# EAGLE design Grove - Mouse Encoder v1.0 (EAGLE 7.2.0)

## Sheet 1 of 3
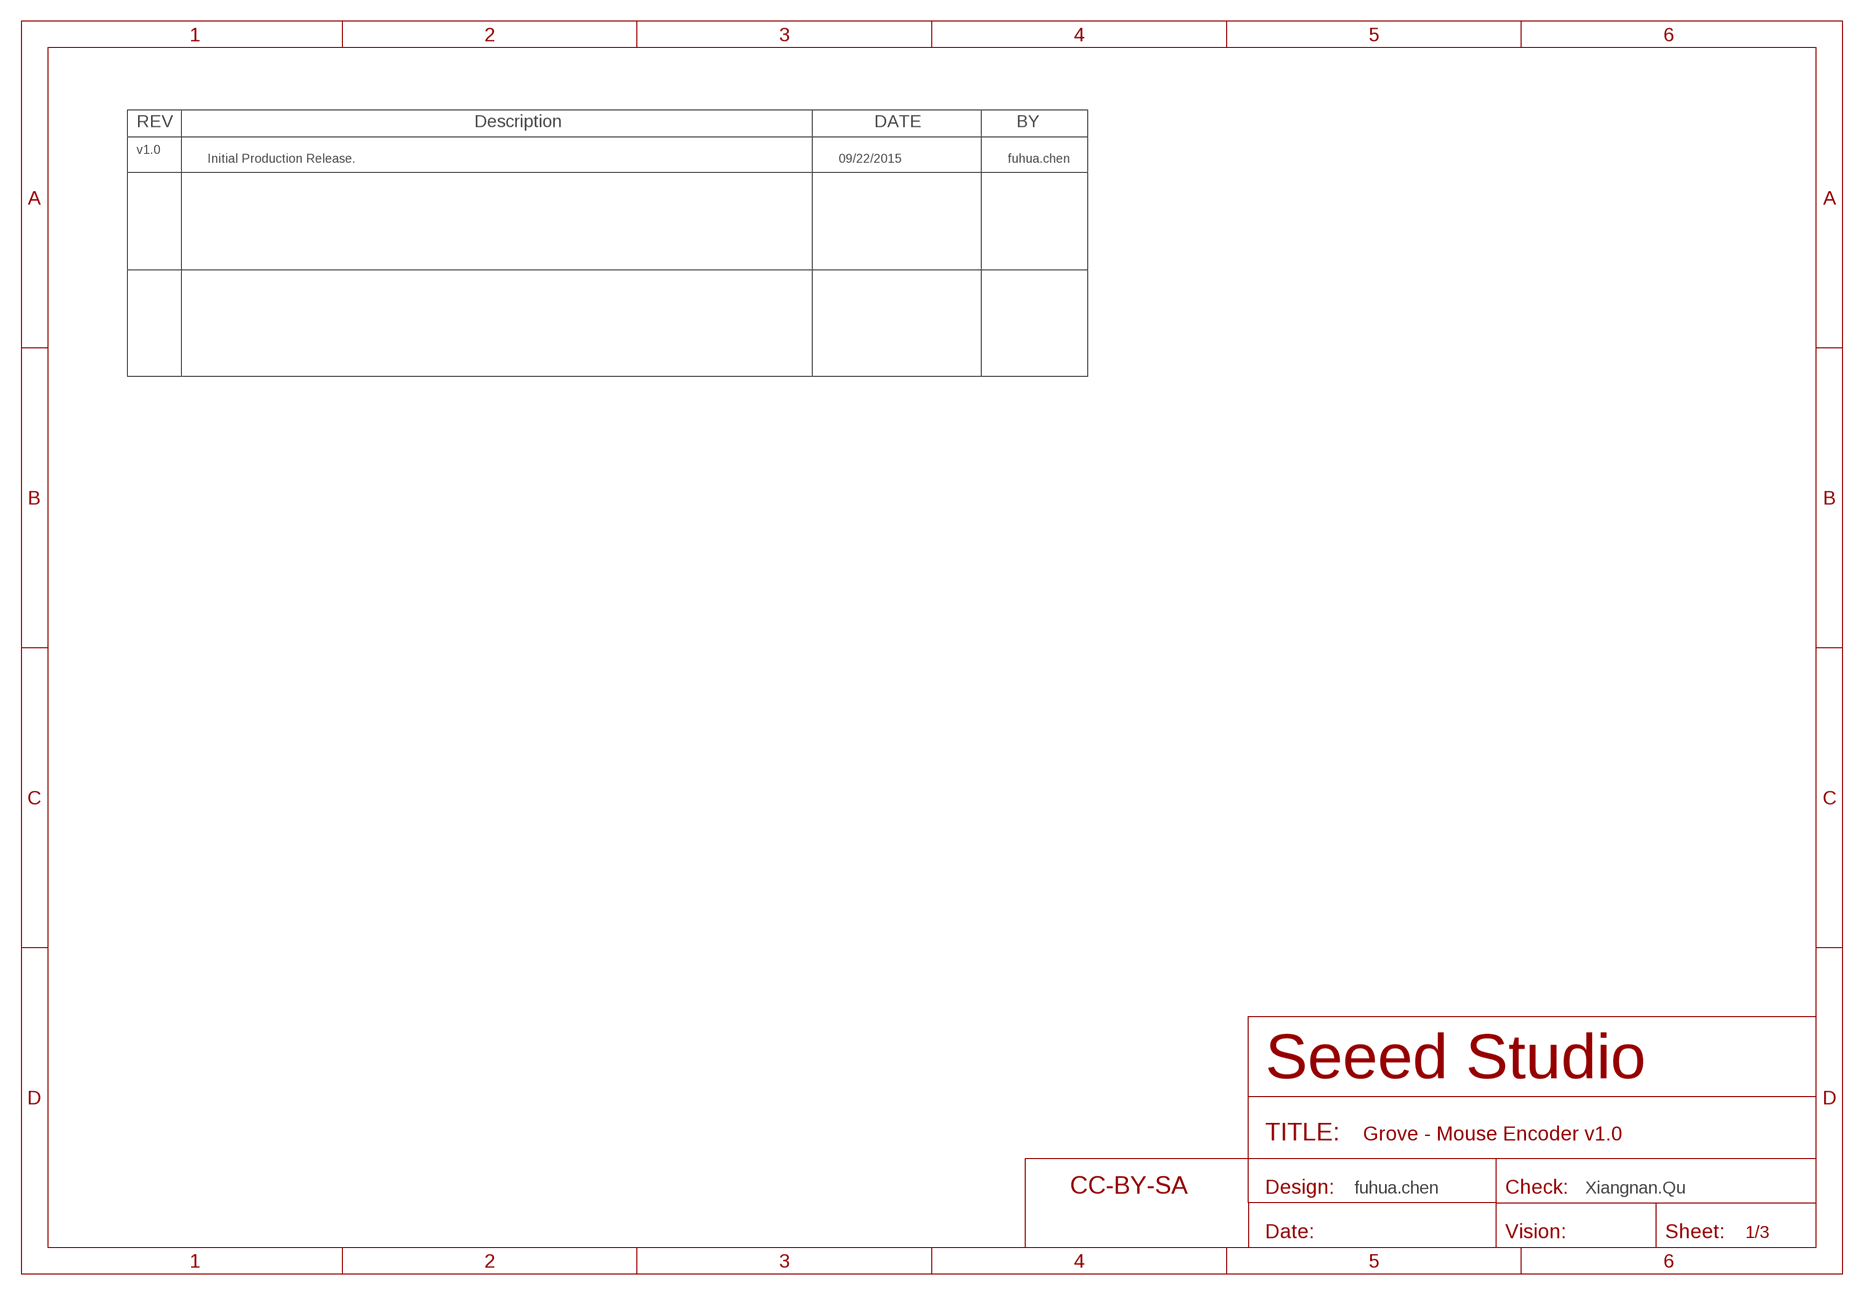
[diagram p0: schematic, sheet 1]

### Parts
U$5  SEEEDSTUDIO-OPEN-SCH-FRAME  [SEEEDSTUDIO-PCB-FRAME]

### Notes on the sheet
- REV | Description | DATE | BY
- v1.0
- Initial Production Release. | 09/22/2015 | fuhua.chen
- fuhua.chen | Xiangnan.Qu

## Sheet 2 of 3
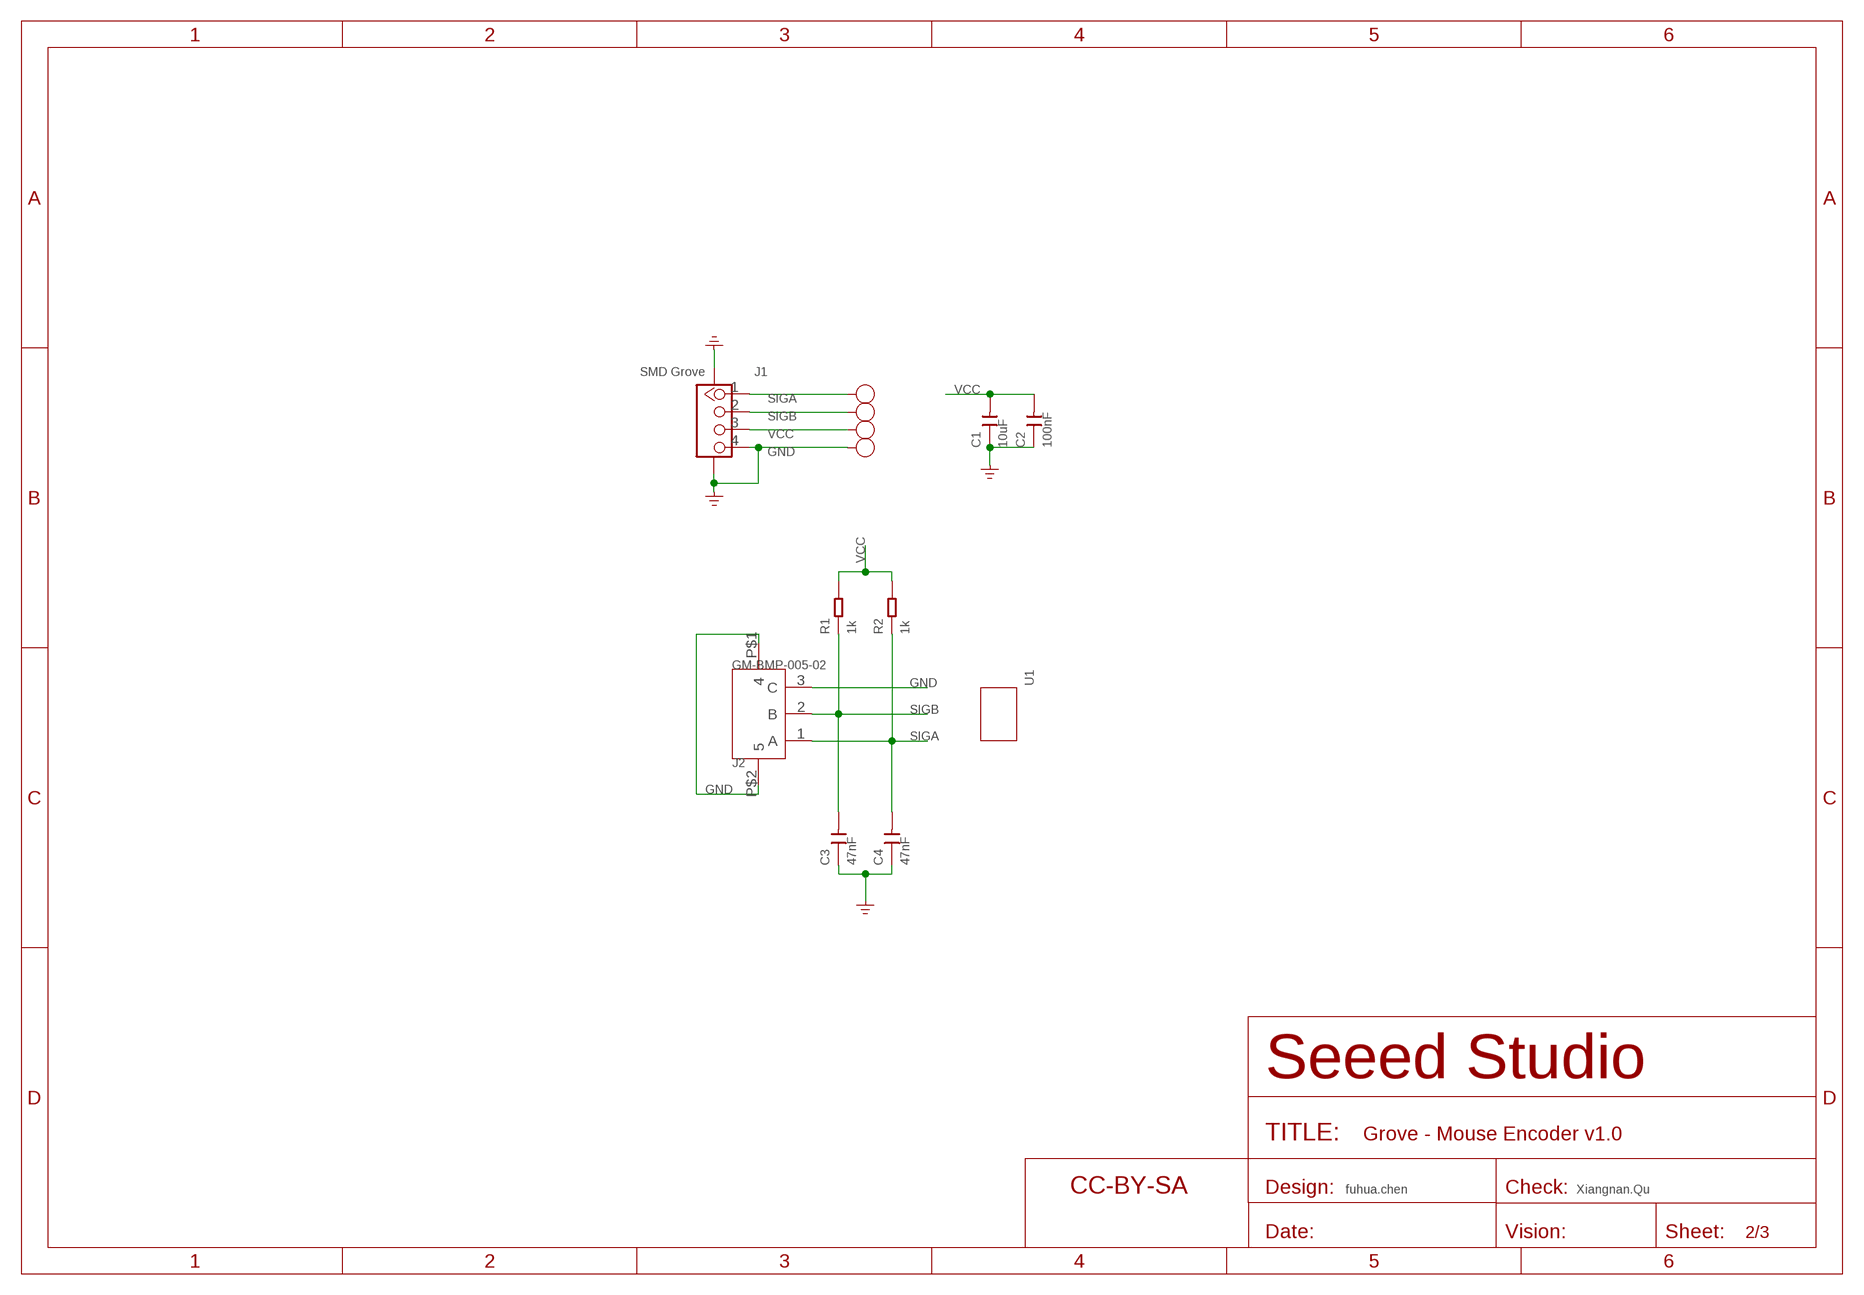
[diagram p1: schematic, sheet 2]

### Parts
C1  10uF  CAP-0603  [C0603]
C2  100nF  CAP-0603  [C0603]
C3  47nF  CAP-0603  [C0603]
C4  47nF  CAP-0603  [C0603]
FR1  SEEEDSTUDIO-OPEN-SCH-FRAME  [SEEEDSTUDIO-PCB-FRAME]
GND  GND  TEST-POINT'4545'  [TP-D45MIL]
J1  SMD Grove  GROVE-CONNECTOR-SMD'90D'  [HW4-SMD-2.0-90D]
J2  GM-BMP-005-02  ENCODER-BM002  [DIP5-2.5-10.8X6.8X11.1MM]
R1  1k  RES-0603  [R0603]
R2  1k  RES-0603  [R0603]
SIGA  SIGA  TEST-POINT'4545'  [TP-D45MIL]
SIGB  SIGB  TEST-POINT'4545'  [TP-D45MIL]
U1  GROVE'1U'  [GROVE-1X1-TEST-PLATFORM]
VCC  VCC  TEST-POINT'4545'  [TP-D45MIL]

### Nets
GND: C1.1 C2.1 C3.1 C4.1 GND.T J1.4 J1.SS1 J1.SS2 J2.3(C) J2.P$1 J2.P$2 ; supply symbol labelled GND_POWER
SIGA: C4.2 J1.1 J2.1(A) R2.1 SIGA.T
SIGB: C3.2 J1.2 J2.2(B) R1.1 SIGB.T
VCC: C1.2 C2.2 J1.3 R1.2 R2.2 VCC.T

### Notes on the sheet
- fuhua.chen | Xiangnan.Qu

## Sheet 3 of 3
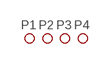
[diagram p2: schematic, sheet 3]

### Parts
P1  PAD-MARK'ANNULAR'  [ROUND-MARK-1.0]
P2  PAD-MARK'ANNULAR'  [ROUND-MARK-1.0]
P3  PAD-MARK'ANNULAR'  [ROUND-MARK-1.0]
P4  PAD-MARK'ANNULAR'  [ROUND-MARK-1.0]

## Library data of the parts
C1-C4 = Discrete-new:CAP: Ceramic Capacitors
FR1 U$5 = moudle-new:SEEEDSTUDIO-OPEN-SCH-FRAME
GND SIGA SIGB VCC = Discrete-new:TEST-POINT; PARTNO: DNP
J1 = Connector-new:GROVE-CONNECTOR-SMD: 4P-SMD-2.0:320110030;4P-SMD-2.0-90D:320110032
J2 = template:ENCODER-BM002
P1-P4 = Discrete-new:PAD-MARK; PARTNO: DNP
R1 R2 = Discrete-new:RES
U1 = moudle-new:GROVE

## Board
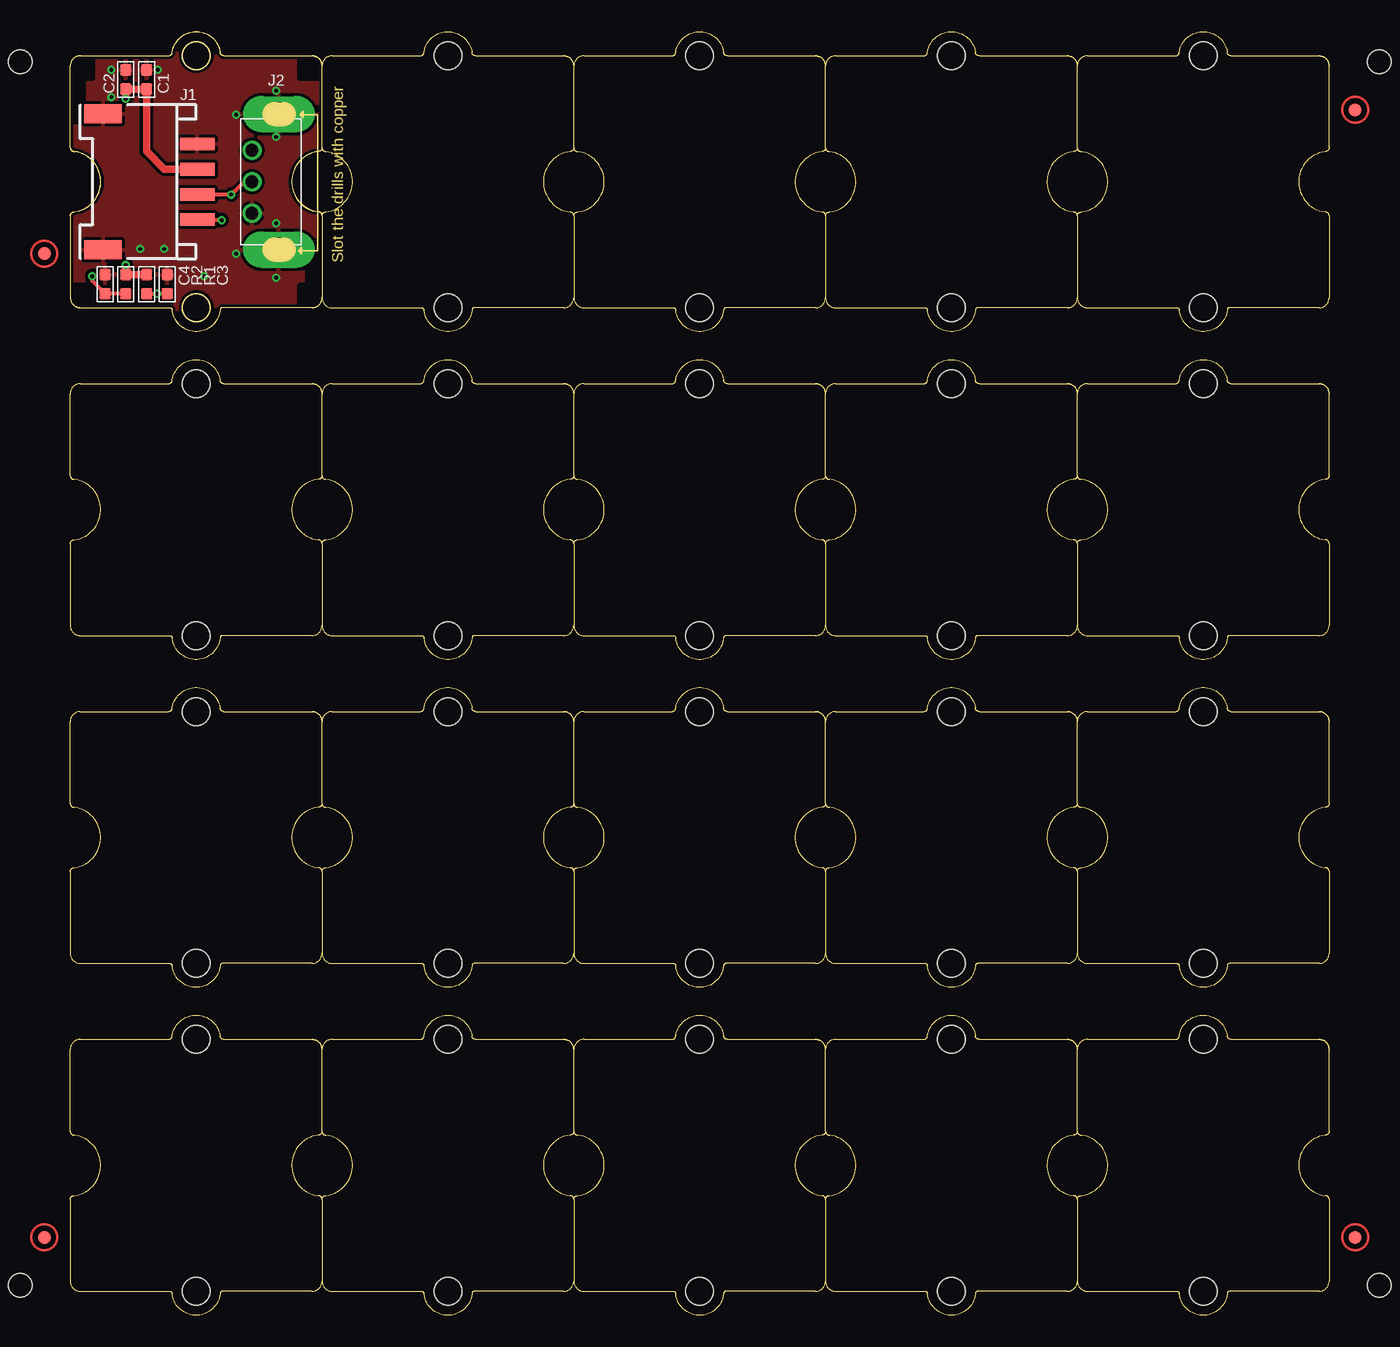
[diagram p3: board, top side]
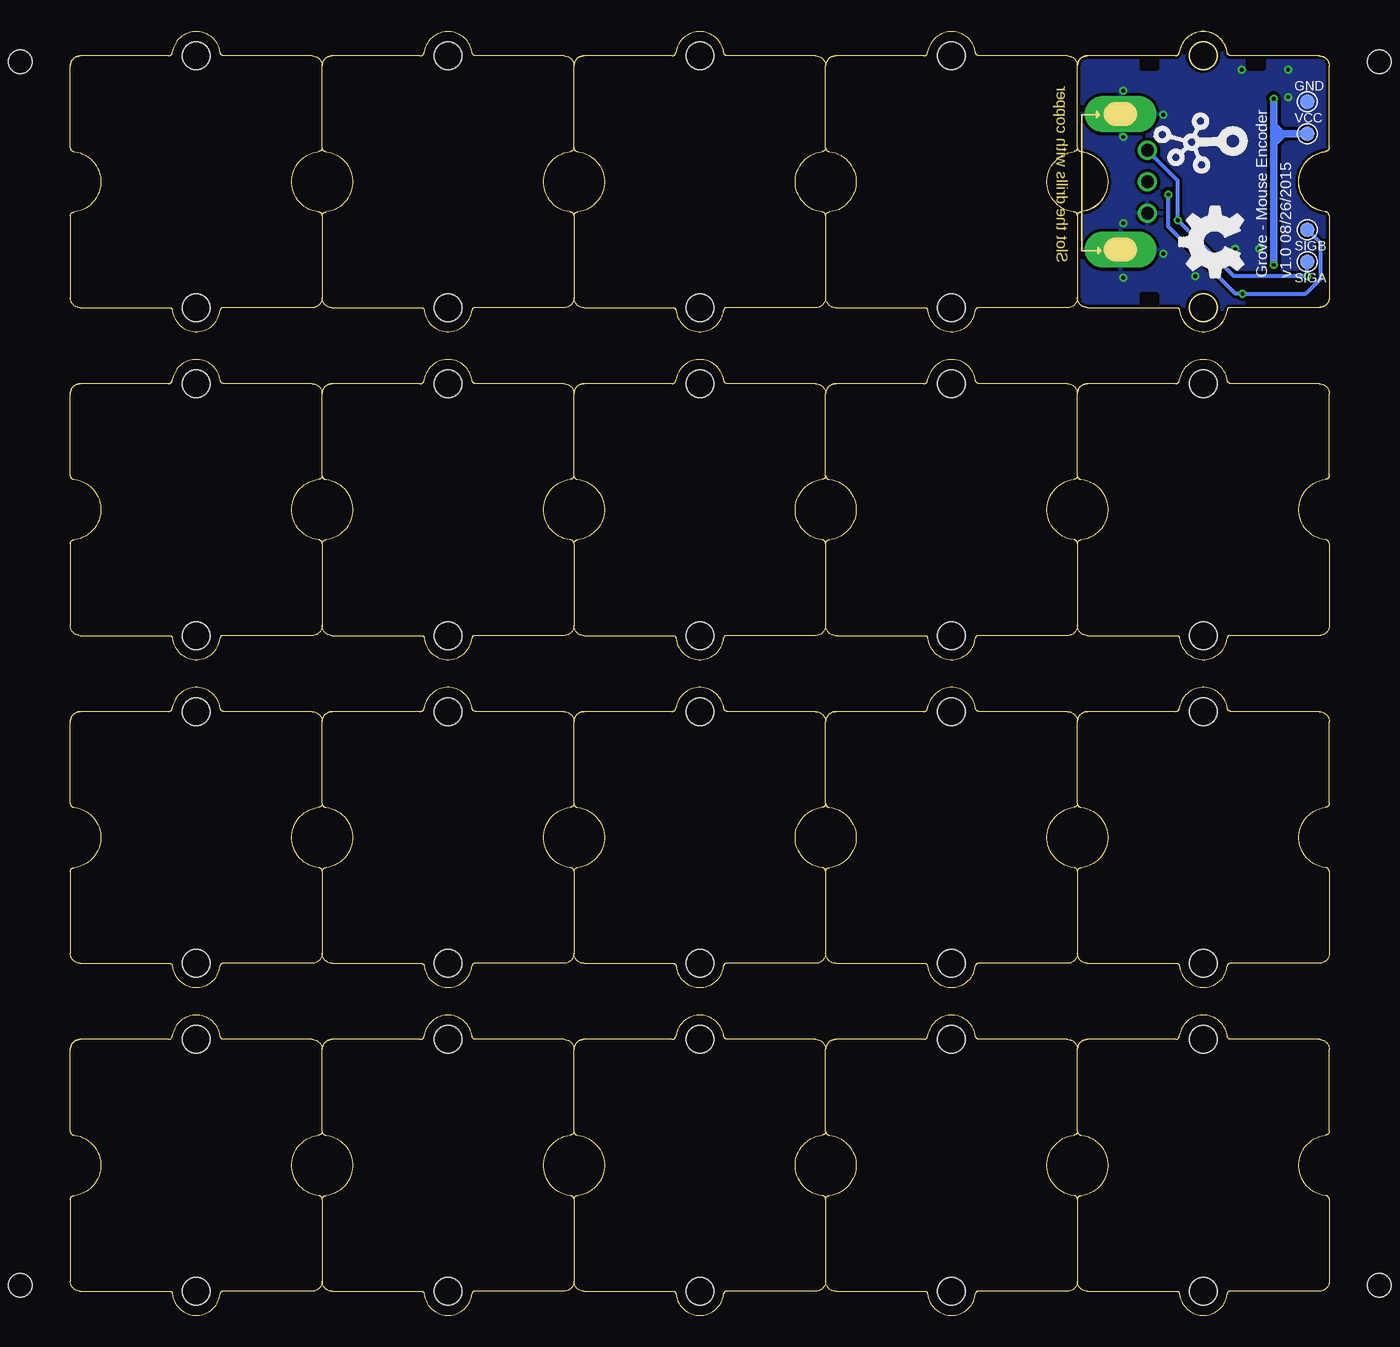
[diagram p4: board, bottom side, seen from below]

Size 100 x 101.95 mm. Coordinates in mm from the lower left corner, seen from the top.
Copper layers (1*16): Top 0.035mm / dielectric 1.5mm / Bottom 0.035mm
Design rules "SeeedStudio_2layer_DRU_no_angle_20140221 *": minimum track width 6mil, minimum drill 12mil, track to track 6mil, track to pad 6mil, pad to pad 6mil, via to via 6mil, smd to smd 0mil, copper to edge 10mil, drill to drill 10mil, minimum pad ring 10mil, minimum via ring 6mil, stop-mask expansion 2mil, vias tented up to drill 25mil, thermal gap 10mil
Holes 1.91 mm at -3.97,2.38 -3.97,99.54 103.98,99.54 103.98,2.38

### Footprints (pad centres in the part's own frame; a part is rotated, then mirrored left to right if it is on the bottom)
C0603 = smd 0.889 x 0.889: 1 0,0.762; 2 0,-0.762
TP-D45MIL = smd 1.143 x 1.143: T 0,0
HW4-SMD-2.0-90D = smd 1.01 x 2.74: 1 -3,-0.1; 2 -1,-0.1; 3 1,-0.1; 4 3,-0.1 | smd 1.5 x 3: SS1 -5.4,7.4; SS2 5.4,7.4
DIP5-2.5-10.8X6.8X11.1MM = drill 1: 1 -2.5,0; 2 0,0; 3 2.5,0 | drill 1.9 pad 2.2 long: P$1 5.38,2.127; P$2 -5.38,2.127
ROUND-MARK-1.0 = smd 1.016 x 1.016: P$1 0,0
R0603 = smd 0.889 x 0.889: 1 0,0.762; 2 0,-0.762
GROVE-1X1-TEST-PLATFORM = hole 2.2: 9.987,0.013; -10.013,0.013
GROVE-1*1-TEST-PLATFORM = hole 2.2: 0,-10; 0,10

### Placement (x,y rotation side)
C1  6.06,98.14 0 top
C2  4.41,98.14 0 top
C3  7.71,81.89 0 top
C4  2.76,81.89 0 top
FR1  -5.11,-9.3 0 top  (outside the outline)
GND  1.74,96.36 0 bottom
J1  10,90.01 90 top
J2  14.45,90.01 270 top
P1  -2.06,6.19 0 top
P2  102.08,6.19 0 top
P3  -2.06,84.3 0 top
P4  102.08,95.73 0 top
R1  6.06,81.89 180 top
R2  4.41,81.89 180 top
SIGA  1.74,83.66 0 bottom
SIGB  1.74,86.2 0 bottom
U1  10,90.01 270 top
U$1  [OSHW_FILLX200_NOTEXT]  6.83,82.39 90 bottom
U$2  [GROVE-SILK-BIG]  7.46,93.19 90 bottom
U$3  [GROVE-1*1-TEST-PLATFORM]  10,90.01 0 top
U$4  [GROVE-1*1-TEST-PLATFORM]  30,90.01 0 top
U$5  -12.73,-18.7 0 top  (outside the outline)
U$7  [GROVE-1*1-TEST-PLATFORM]  50,90.01 0 top
U$8  [GROVE-1*1-TEST-PLATFORM]  70,90.01 0 top
U$9  [GROVE-1*1-TEST-PLATFORM]  90,90.01 0 top
U$10  [GROVE-1*1-TEST-PLATFORM]  30,63.98 0 top
U$11  [GROVE-1*1-TEST-PLATFORM]  50,63.98 0 top
U$12  [GROVE-1*1-TEST-PLATFORM]  70,63.98 0 top
U$13  [GROVE-1*1-TEST-PLATFORM]  90,63.98 0 top
U$14  [GROVE-1*1-TEST-PLATFORM]  10,63.98 0 top
U$15  [GROVE-1*1-TEST-PLATFORM]  30,37.94 0 top
U$16  [GROVE-1*1-TEST-PLATFORM]  50,37.94 0 top
U$17  [GROVE-1*1-TEST-PLATFORM]  70,37.94 0 top
U$18  [GROVE-1*1-TEST-PLATFORM]  90,37.94 0 top
U$19  [GROVE-1*1-TEST-PLATFORM]  10,37.94 0 top
U$20  [GROVE-1*1-TEST-PLATFORM]  30,11.91 0 top
U$21  [GROVE-1*1-TEST-PLATFORM]  50,11.91 0 top
U$22  [GROVE-1*1-TEST-PLATFORM]  70,11.91 0 top
U$23  [GROVE-1*1-TEST-PLATFORM]  90,11.91 0 top
U$24  [GROVE-1*1-TEST-PLATFORM]  10,11.91 0 top
VCC  1.74,93.82 0 bottom

### Tracks (layer width: path | path; a pad name or v marks a point on that pad's centre or on a via)
GND  (via drill 0.3 pad 0.64)
  other vias: 13.18,84.3 16.35,82.39 16.35,86.71 16.35,93.57 13.18,95.35 16.35,97.25 3.27,98.9 6.95,98.9 5.55,84.68 7.46,84.68 10.63,82.52 3.27,96.74
  pour Top (isolate 0.254, rank 6): -0.16,100.81 20.16,100.81 20.16,79.22 -0.16,79.22
  pour Bottom (isolate 0.254, rank 6): -0.16,100.81 20.16,100.81 20.16,79.22 -0.16,79.22
SIGA  (via drill 0.3 pad 0.64)
  Top 0.305: v1.74,82.52 1.74,82.14 C4.2 R2.1 | v12.03,86.97 10.15,86.97 J1.1
  Bottom 0.305: SIGA.T v1.74,82.52 7.59,82.52 v12.03,86.97 12.03,90.1 J2.1
SIGB  (via drill 0.3 pad 0.64)
  Top 0.305: R1.1 v6.89,81.12 C3.2 | J1.2 10.12,89 v12.79,89 13.81,90.01 J2.2
  Bottom 0.305: SIGB.T 0.73,85.19 0.73,82.27 1.87,81.12 v6.89,81.12 7.46,81.12 12.79,86.46 v12.79,89
VCC  (via drill 0.3 pad 0.64)
  Top 0.61: J1.3 7.48,91.01 6.06,92.43 C1.2 C2.2 v4.41,96.62 | v4.41,83.41 R2.2 R1.2
  Bottom 0.61: v4.41,96.62 4.41,94.46 | 4.41,94.46 4.41,93.82 | 4.41,93.82 4.41,93.06 | 4.41,93.06 v4.41,83.41 | VCC.T 3.4,93.82 3.65,93.82 | 3.78,93.82 4.41,93.82 | 3.65,93.82 3.78,93.82 | 3.78,93.82 4.41,94.46 | 3.65,93.82 4.41,93.06

### Text on the board
bPlace: v1.0 08/26/2015 | Grove - Mouse Encoder